# EAGLE board FindMeSAT_MB_1V0 (EAGLE 7.7.0)
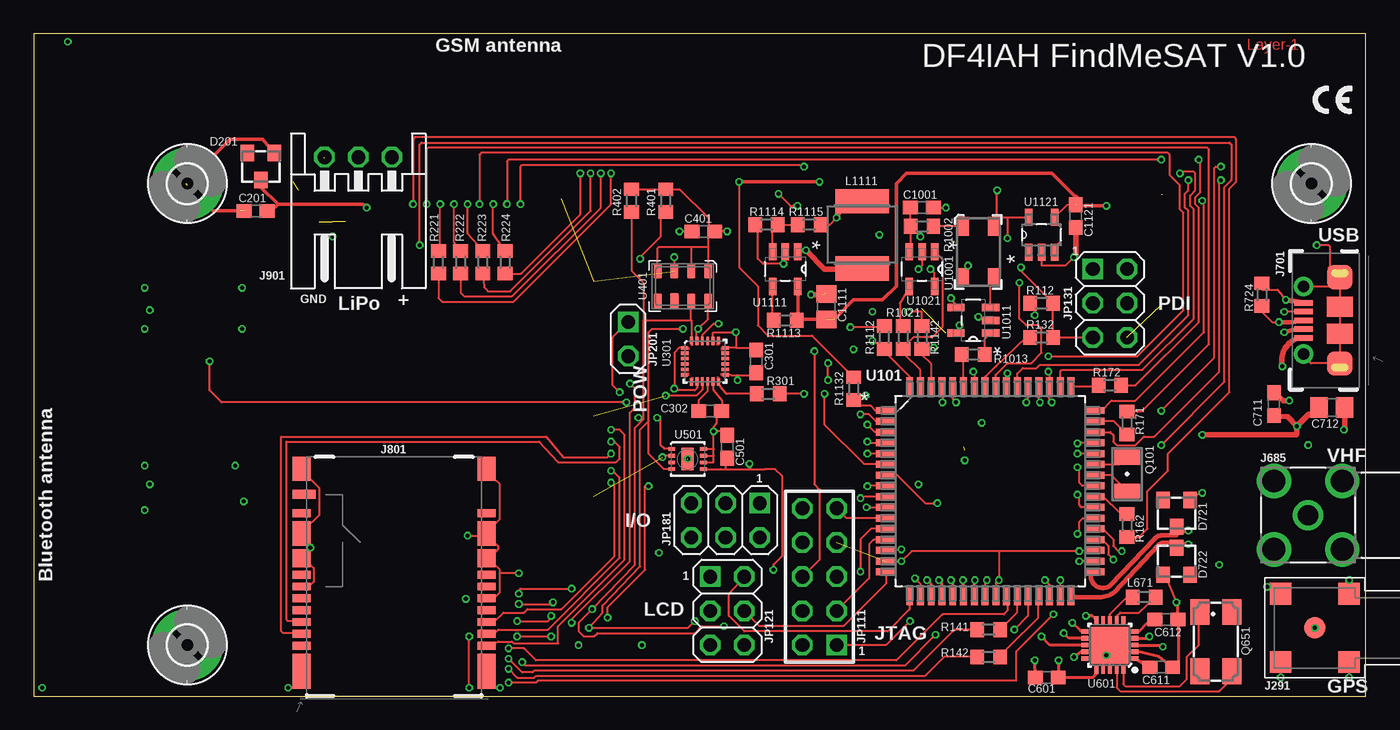
[diagram p12: board, top side]
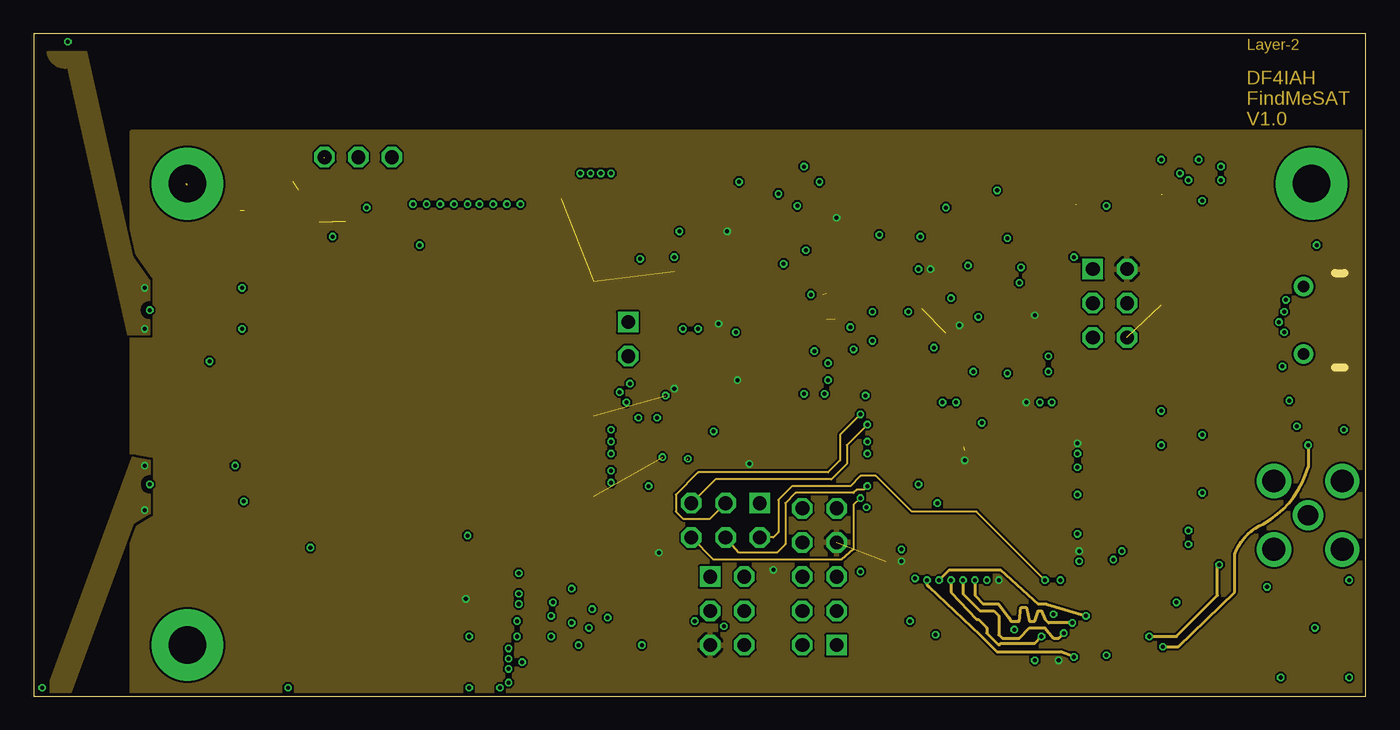
[diagram p13: board, inner layer g2]
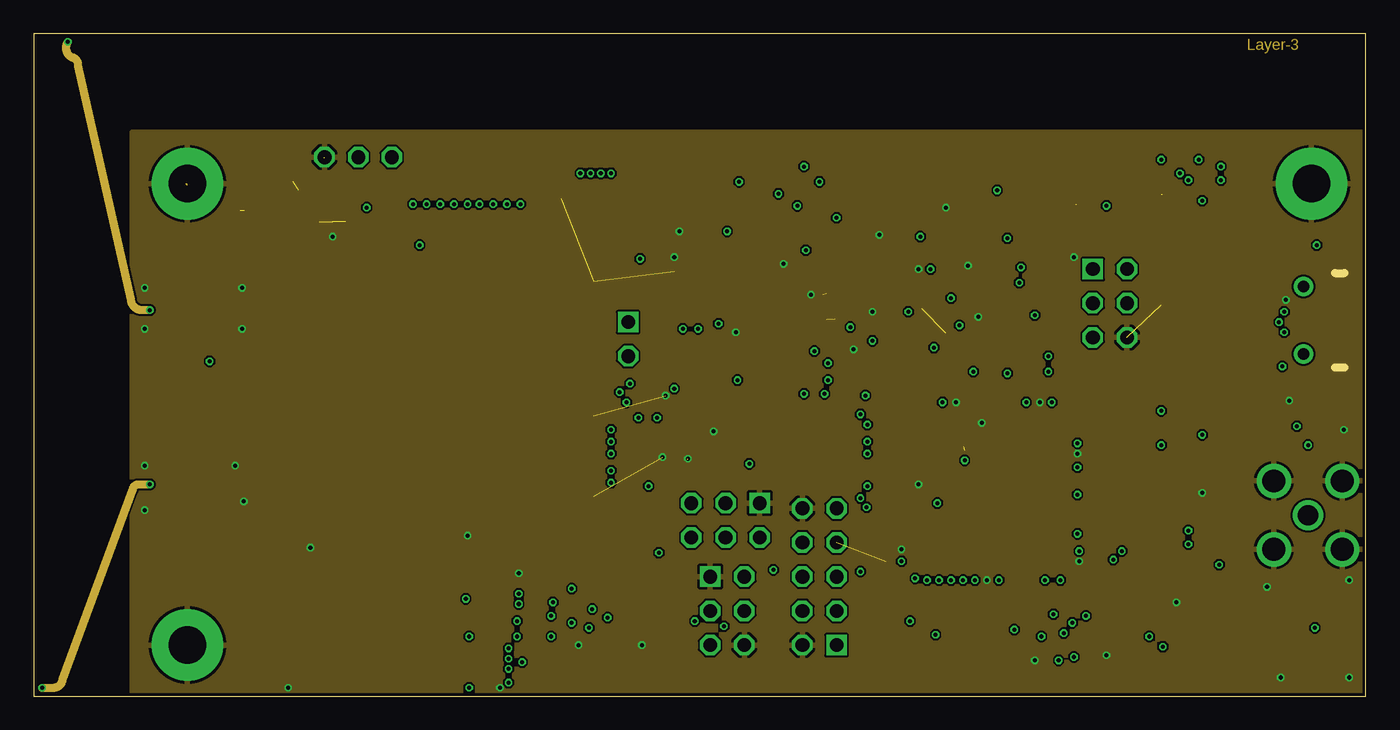
[diagram p14: board, inner layer g15]
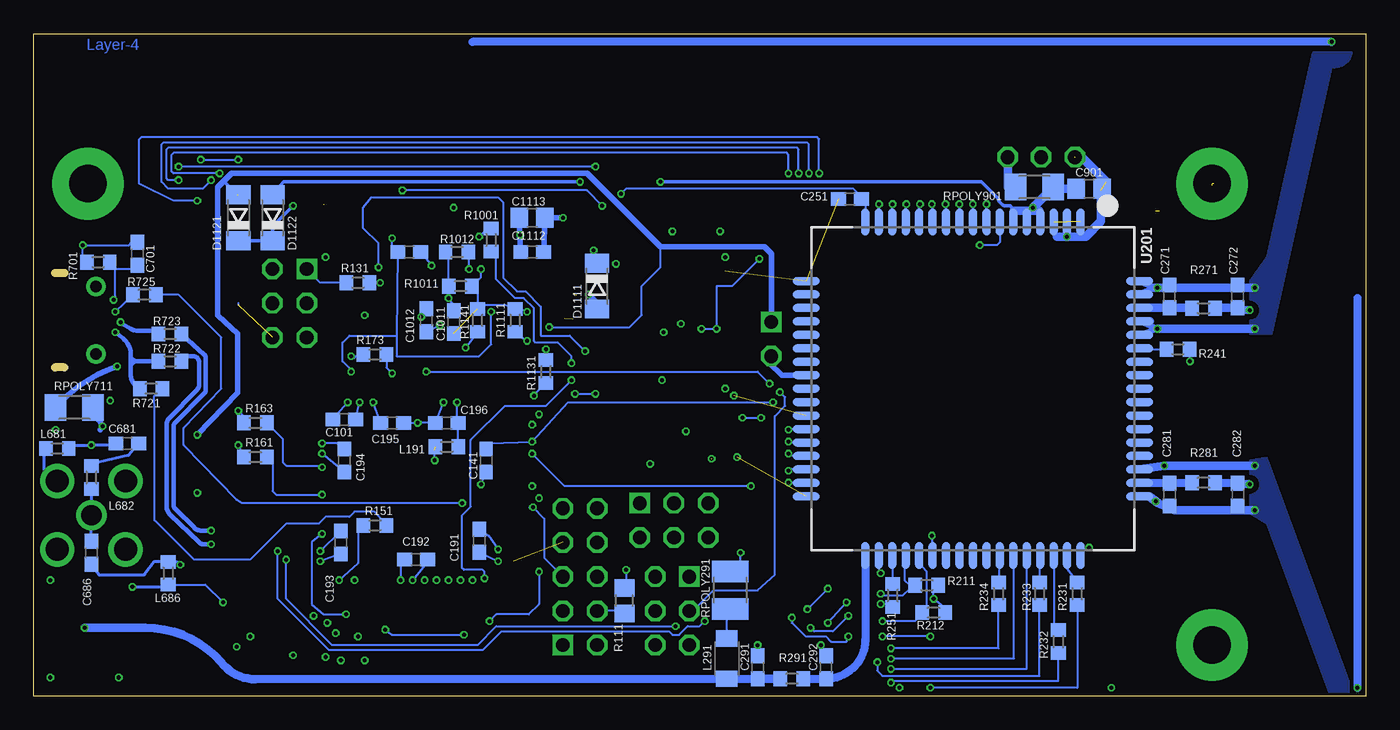
[diagram p15: board, bottom side, seen from below]

Size 99.04 x 49.23 mm. Coordinates in mm from the lower left corner, seen from the top.
Outline: 99.04,49.23 0,49.23 0,0 99.04,0 99.04,49.23
Copper layers (1+2*15+16): Top 0.018mm / dielectric 0.36mm / g2 0.035mm / dielectric 0.71mm / g15 0.035mm / dielectric 0.36mm / Bottom 0.018mm
Design rules "FindMeSAT_MB_1V0 *": minimum track width 0.15mm, minimum drill 0.3mm, track to track 0.15mm, track to pad 0.15mm, pad to pad 0.15mm, via to via 0.15mm, smd to smd 0mil, copper to edge 0.25mm, drill to drill 0.35mm, minimum pad ring 0.175mm, minimum via ring 0.125mm, stop-mask expansion 0.05mm, vias tented up to drill 0.35mm, thermal gap 0.2mm
Net classes: 1 pwr2A: width 0.8 mm; 2 R50: width 0.64 mm, clearance 0.55 mm; 3 R90_USB: width 0.35 mm, clearance 0.15 mm; 4 pwrA5: width 0.4 mm; 5 R75: width 0.3 mm, clearance 0.2 mm; 6 R110_SPI: width 0.225 mm, clearance 0.15 mm
tKeepout: area 0,0 to 99.1,49.2
bKeepout: area 0,0 to 99.1,49.2
tRestrict: area 21.6,1.3 to 31.8,17.8
bRestrict: area 19.1,12.7 to 39.4,33

## Footprints (pad centres in the part's own frame; a part is rotated, then mirrored left to right if it is on the bottom)
C0603 = smd 1.1 x 1: 1 -0.85,0; 2 0.85,0
C0805 = smd 1.3 x 1.5: 1 -0.95,0; 2 0.95,0
TO236 = smd 1 x 1.2: A -1,-1; C 0,1; NC 1,-1
SOD80C = smd 1.4 x 1.8: A 1.7,0; C -1.7,0
2,8-PAD = drill 2.8 pad 5.334: B2,8 0,0
MCX-J-P-X-RA-SM1 = smd 1.6 x 1.6: 1 0,0; 2 -2.54,2.54; 3 2.54,2.54; 4 -2.54,-2.54; 5 2.54,-2.54
SMA_SMT_AMPHENOL_901-143 = drill 1.499: 1 0,0 | drill 1.702: 2 -2.54,2.54; 3 -2.54,-2.54; 4 2.54,-2.54; 5 2.54,2.54
USB-B-MICRO-SMD_MOLEX-105017-0001 = smd 0.4 x 1.35: D+ 0,4.15; D- -0.65,4.15; GND 1.3,4.15; ID 0.65,4.15; VBUS -1.3,4.15 | drill 0.85 pad 1.45: JSHIELD -2.5,4.15; JSHIELD@2 2.5,4.15 | smd 1.8 x 1.9: JSHIELD@3 -3.2,1.45; JSHIELD@6 3.2,1.45 | smd 1.5 x 1.9: JSHIELD@4 -1,1.45; JSHIELD@5 1,1.45
MICROSIM-8P_SDCARD-8P_MOLEX-104642-1610 = smd 1.35 x 2.6: G1 -6.875,-7.04; G8 6.875,-7.04 | smd 1.35 x 1.34: G2 -6.875,1.36; G7 6.875,1.36 | smd 1.35 x 1.84: G3 -6.875,3.2; G6 6.875,3.2 | smd 1.35 x 1.8: G4 -6.875,8.01; G5 6.875,8.01 | smd 1.35 x 0.58: S1 6.875,-5.13; S2 6.875,-4.25; S3 -6.875,-4.25; S4 -6.875,-5.13; S5 6.875,-1.61; S6 6.875,-3.37; S7 -6.875,-3.37; S8 -6.875,-1.61; T1 6.875,4.71; T2 6.875,0.15; T3 6.875,-0.73; T4 6.875,-2.49; T5 -6.875,-2.49; T6 -6.875,-0.73; T7 -6.875,0.15; T8 -6.875,4.71 | smd 1.7 x 0.7: SW -6.7,6.125
JST_S3B-XH-A = drill 1.016 octagon: 1 -2.5,-4.5; 2 0,-4.5; 3 2.5,-4.5
AVR-JTAG-10 = drill 1.016 square: 1 -5.08,-1.27 | drill 1.016 octagon: 2 -5.08,1.27; 3 -2.54,-1.27; 4 -2.54,1.27; 5 0,-1.27; 6 0,1.27; 7 2.54,-1.27; 8 2.54,1.27; 9 5.08,-1.27; 10 5.08,1.27
2X03 = drill 1.016 square: 1 -2.54,-1.27 | drill 1.016 octagon: 2 -2.54,1.27; 3 0,-1.27; 4 0,1.27; 5 2.54,-1.27; 6 2.54,1.27
1X02 = drill 1.016 square: 1 0,0 | drill 1.016 octagon: 2 0,2.54
R0603 = smd 1 x 1.1: 1 -0.85,0; 2 0.85,0
L3216C = smd 1.2 x 1.6: 1 -1.5,0; 2 1.5,0
L5650M = smd 1.8 x 4: 1 -2.5,0; 2 2.5,0
ABS07 = smd 1.1 x 1.9: 1 -1.25,0; 2 1.25,0
CTS406 = smd 1.9 x 1.4: 1 -2.2,-1.2; 2 2.2,-1.2; 3 2.2,1.2; 4 -2.2,1.2
R0805 = smd 1.3 x 1.5: 1 -0.95,0; 2 0.95,0
R1210 = smd 1.6 x 2.7: 1 -1.4,0; 2 1.4,0
M1206 = smd 1.6 x 2: 1 -1.4,0; 2 1.4,0
QFP80P1600X1600X120-64N = smd 1.473 x 0.508: 1 -7.747,5.994; 2 -7.747,5.207; 3 -7.747,4.394; 4 -7.747,3.607; 5 -7.747,2.794; 6 -7.747,2.007; 7 -7.747,1.194; 8 -7.747,0.406; 9 -7.747,-0.406; 10 -7.747,-1.194; 11 -7.747,-2.007; 12 -7.747,-2.794; 13 -7.747,-3.607; 14 -7.747,-4.394; 15 -7.747,-5.207; 16 -7.747,-5.994; 33 7.747,-5.994; 34 7.747,-5.207; 35 7.747,-4.394; 36 7.747,-3.607; 37 7.747,-2.794; 38 7.747,-2.007; 39 7.747,-1.194; 40 7.747,-0.406; 41 7.747,0.406; 42 7.747,1.194; 43 7.747,2.007; 44 7.747,2.794; 45 7.747,3.607; 46 7.747,4.394; 47 7.747,5.207; 48 7.747,5.994 | smd 0.508 x 1.473: 17 -5.994,-7.747; 18 -5.207,-7.747; 19 -4.394,-7.747; 20 -3.607,-7.747; 21 -2.794,-7.747; 22 -2.007,-7.747; 23 -1.194,-7.747; 24 -0.406,-7.747; 25 0.406,-7.747; 26 1.194,-7.747; 27 2.007,-7.747; 28 2.794,-7.747; 29 3.607,-7.747; 30 4.394,-7.747; 31 5.207,-7.747; 32 5.994,-7.747; 49 5.994,7.747; 50 5.207,7.747; 51 4.394,7.747; 52 3.607,7.747; 53 2.794,7.747; 54 2.007,7.747; 55 1.194,7.747; 56 0.406,7.747; 57 -0.406,7.747; 58 -1.194,7.747; 59 -2.007,7.747; 60 -2.794,7.747; 61 -3.607,7.747; 62 -4.394,7.747; 63 -5.207,7.747; 64 -5.994,7.747
SIM808 = smd 2 x 0.6: P$1 -12.4,8; P$2 -12.4,7; P$3 -12.4,6; P$4 -12.4,5; P$5 -12.4,4; P$6 -12.4,3; P$7 -12.4,2; P$8 -12.4,1; P$9 -12.4,0; P$10 -12.4,-1; P$11 -12.4,-2; P$12 -12.4,-3; P$13 -12.4,-4; P$14 -12.4,-5; P$15 -12.4,-6; P$16 -12.4,-7; P$17 -12.4,-8; P$35 12.4,-8; P$36 12.4,-7; P$37 12.4,-6; P$38 12.4,-5; P$39 12.4,-4; P$40 12.4,-3; P$41 12.4,-2; P$42 12.4,-1; P$43 12.4,0; P$44 12.4,1; P$45 12.4,2; P$46 12.4,3; P$47 12.4,4; P$48 12.4,5; P$49 12.4,6; P$50 12.4,7; P$51 12.4,8 | smd 0.6 x 2: P$18 -8,-12.4; P$19 -7,-12.4; P$20 -6,-12.4; P$21 -5,-12.4; P$22 -4,-12.4; P$23 -3,-12.4; P$24 -2,-12.4; P$25 -1,-12.4; P$26 0,-12.4; P$27 1,-12.4; P$28 2,-12.4; P$29 3,-12.4; P$30 4,-12.4; P$31 5,-12.4; P$32 6,-12.4; P$33 7,-12.4; P$34 8,-12.4; P$52 8,12.4; P$53 7,12.4; P$54 6,12.4; P$55 5,12.4; P$56 4,12.4; P$57 3,12.4; P$58 2,12.4; P$59 1,12.4; P$60 0,12.4; P$61 -1,12.4; P$62 -2,12.4; P$63 -3,12.4; P$64 -4,12.4; P$65 -5,12.4; P$66 -6,12.4; P$67 -7,12.4; P$68 -8,12.4
QFN24-3X3 = smd 0.495 x 0.25: 1 -1.552,1; 6 -1.552,-1; 13 1.552,-1; 18 1.552,1 | smd 0.6 x 0.25: 2 -1.5,0.6; 3 -1.5,0.2; 4 -1.5,-0.2; 5 -1.5,-0.6; 14 1.5,-0.6; 15 1.5,-0.2; 16 1.5,0.2; 17 1.5,0.6 | smd 0.25 x 0.495: 7 -1,-1.552; 12 1,-1.552; 19 1,1.552; 24 -1,1.552 | smd 0.25 x 0.6: 8 -0.6,-1.5; 9 -0.2,-1.5; 10 0.2,-1.5; 11 0.6,-1.5; 20 0.6,1.5; 21 0.2,1.5; 22 -0.2,1.5; 23 -0.6,1.5
MS5607-02BA = smd 1.1 x 0.6: 1 -1.1,1.875; 2 -1.1,0.625; 3 -1.1,-0.625; 4 -1.1,-1.875; 5 1.1,-1.875; 7 1.1,0.625; 8 1.1,1.875 | smd 1.1 x 0.67: 6 1.1,-0.625
DFN8/SHT = smd 0.55 x 0.25: 1 0.075,2; 2 0.075,1.5; 3 0.075,1; 4 0.075,0.5; 5 2.425,0.5; 6 2.425,1; 7 2.425,1.5; 8 2.425,2 | smd 0.9 x 1.7: 9 1.25,1.25
QFN20-4X4-0P5-PAD = smd 0.6 x 0.35: 1 -1.85,1; 2 -1.85,0.5; 3 -1.85,0; 4 -1.85,-0.5; 5 -1.85,-1; 11 1.85,-1; 12 1.85,-0.5; 13 1.85,0; 14 1.85,0.5; 15 1.85,1 | smd 0.35 x 0.6: 6 -1,-1.85; 7 -0.5,-1.85; 8 0,-1.85; 9 0.5,-1.85; 10 1,-1.85; 16 1,1.85; 17 0.5,1.85; 18 0,1.85; 19 -0.5,1.85; 20 -1,1.85 | smd 2.75 x 2.75: 21 0,0
CFPT-141 = smd 0.9 x 1.4: 1 -1.15,1.9; 2 -1.15,-1.9; 3 1.15,-1.9; 4 1.15,1.9
SOT-23-5 = smd 1.27 x 0.559: 1 -1.295,0.94; 2 -1.295,0; 3 -1.295,-0.94; 4 1.295,-0.94; 5 1.295,0.94
SOT95P280X145-5N = smd 1.27 x 0.559: 1 -1.295,0.94; 2 -1.295,0; 3 -1.295,-0.94; 4 1.295,-0.94; 5 1.295,0.94
SOT95P285X120-5N = smd 1.27 x 0.533: 1 -1.295,0.965; 2 -1.295,0; 3 -1.295,-0.965; 4 1.295,-0.965; 5 1.295,0.965

## Placement (x,y rotation side)
C101  100nF  [C0603]  75.95,20.57 0 bottom
C141  100pF  [C0603]  65.41,17.53 270 bottom
C191  100nF  [C0603]  65.91,11.56 90 bottom
C192  100nF  [C0603]  70.61,10.16 0 bottom
C193  100nF  [C0603]  76.2,11.43 270 bottom
C194  100nF  [C0603]  75.95,17.53 270 bottom
C195  100nF  [C0603]  72.39,20.32 0 bottom
C196  100nF  [C0603]  68.33,20.32 180 bottom
C201  100pF  [C0603]  16.51,36.07 180 top
C251  100pF  [C0603]  38.35,36.96 180 bottom
C271  [C0603]  14.61,29.72 90 bottom
C272  [C0603]  9.53,29.72 90 bottom
C281  [C0603]  14.61,14.99 270 bottom
C282  [C0603]  9.53,14.99 270 bottom
C291  [C0603]  45.21,2.16 90 bottom
C292  [C0603]  40.13,2.16 90 bottom
C301  100nF  [C0603]  53.72,24.89 90 top
C302  100nF  [C0603]  50.29,21.21 0 top
C401  100nF  [C0603]  49.78,34.54 180 top
C501  100nF  [C0603]  51.56,18.54 90 top
C601  100nF  [C0603]  75.31,1.4 180 top
C611  100nF  [C0603]  83.82,2.16 0 top
C612  100nF  [C0603]  84.2,5.71 0 top
C681  68pF  [C0603]  92.08,18.8 0 bottom
C686  18pF  [C0603]  94.74,10.67 90 bottom
C701  1nF  [C0603]  91.31,32.89 270 bottom
C711  100nF  [C0603]  92.2,21.72 90 top
C712  47uF  [C0805]  96.52,21.46 0 top
C901  100uF  [C0805]  20.57,37.72 0 bottom
C1001  100nF  [C0603]  66.04,36.32 0 top
C1002  100nF  [C0603]  71.12,33.02 0 bottom
C1011  100pF  [C0603]  67.82,27.81 270 bottom
C1012  100nF  [C0603]  69.85,27.94 90 bottom
C1111  47uF  [C0805]  58.93,28.96 90 top
C1112  100nF  [C0603]  61.98,33.02 180 bottom
C1113  47uF  [C0805]  61.98,35.56 180 bottom
C1121  100nF  [C0603]  77.47,35.69 270 top
D201  BZX84-5V1  [TO236]  16.89,39.37 180 top
D721  BZX84-3V6  [TO236]  84.96,13.59 180 top
D722  BZX84-3V6  [TO236]  84.96,10.03 0 top
D1111  CRS08  [SOD80C]  57.15,30.48 270 bottom
D1121  CRS08  [SOD80C]  83.82,35.56 90 bottom
D1122  CRS08  [SOD80C]  81.28,35.56 90 bottom
H1201  MOUNT-PAD-ROUND2.8  [2,8-PAD]  95,38.1 180 top
H1203  MOUNT-PAD-ROUND2.8  [2,8-PAD]  11.43,38.1 180 top
H1204  MOUNT-PAD-ROUND2.8  [2,8-PAD]  11.43,3.81 180 top
J291  MCX-J-P-X-RA-SM1  [MCX-J-P-X-RA-SM1]  95.25,5.08 270 top
J685  SMA_CON  [SMA_SMT_AMPHENOL_901-143]  94.74,13.46 270 top
J701  MOLEX_105017-0001  [USB-B-MICRO-SMD_MOLEX-105017-0001]  98.55,27.94 90 top
J801  MICROSIM-8P_SDCARD-8P_MOLEX-104642-1610  [MICROSIM-8P_SDCARD-8P_MOLEX-104642-1610]  26.8,8.89 0 top
J901  JST_S3B-XH-A  [JST_S3B-XH-A]  24.13,35.56 180 top
JP111  [AVR-JTAG-10]  58.42,8.89 90 top
JP121  [2X03]  51.56,6.35 270 top
JP131  [2X03]  80.01,29.21 270 top
JP181  [2X03]  51.44,13.08 180 top
JP201  POW  [1X02]  44.2,27.81 180 top
L191  10uH  [R0603]  68.33,18.54 180 bottom
L291  WE-CBF_300R  [L3216C]  47.5,2.79 270 bottom
L671  22nH  [R0603]  82.55,7.37 0 top
L681  150nH  [R0603]  97.28,18.41 180 bottom
L682  68nH  [R0603]  94.74,16.26 270 bottom
L686  150nH  [R0603]  89.03,9.14 90 bottom
L1111  4.7uH  [L5650M]  61.59,34.29 270 top
Q101  ABS07-32.768KHZ  [ABS07]  81.28,16.51 90 top
Q651  ABM3B-16MHZ-10-R50-1-U  [CTS406]  87.88,4.06 270 top
R111  0R  [R0805]  55.12,7.11 90 bottom
R112  10kR  [R0603]  74.93,29.21 180 top
R131  68R  [R0603]  74.93,30.73 0 bottom
R132  68R  [R0603]  74.93,26.67 180 top
R141  68R  [R0603]  70.99,4.95 180 top
R142  68R  [R0603]  70.99,2.92 180 top
R151  68R  [R0603]  73.66,12.7 0 bottom
R161  4.7kR  [R0603]  82.55,17.78 180 bottom
R162  68R  [R0603]  81.28,12.7 270 top
R163  68R  [R0603]  82.55,20.32 180 bottom
R171  68R  [R0603]  81.28,20.32 90 top
R172  68R  [R0603]  80.01,23.11 0 top
R173  68R  [R0603]  73.66,25.4 180 bottom
R211  10kR  [R0603]  32.64,8.26 180 bottom
R212  10kR  [R0603]  32.13,6.22 180 bottom
R221  68R  [R0603]  30.1,32.26 90 top
R222  68R  [R0603]  31.75,32.26 90 top
R223  68R  [R0603]  33.4,32.26 90 top
R224  68R  [R0603]  35.05,32.26 90 top
R231  68R  [R0603]  21.46,7.62 270 bottom
R232  68R  [R0603]  22.86,4.06 270 bottom
R233  68R  [R0603]  24.26,7.62 270 bottom
R234  68R  [R0603]  27.3,7.62 270 bottom
R241  68R  [R0603]  13.97,25.78 0 bottom
R251  68R  [R0603]  35.18,7.49 90 bottom
R271  [R0603]  12.06,28.83 0 bottom
R281  [R0603]  12.06,15.88 0 bottom
R291  [R0603]  42.67,1.31 0 bottom
R301  68R  [R0603]  54.61,22.48 0 top
R401  10kR  [R0603]  46.99,36.83 90 top
R402  10kR  [R0603]  44.45,36.83 90 top
R701  330kR  [R0603]  94.23,32.26 0 bottom
R721  1.5kR  [R0603]  90.3,22.86 0 bottom
R722  68R  [R0603]  88.9,24.89 0 bottom
R723  68R  [R0603]  88.9,26.92 0 bottom
R724  1MR  [R0603]  91.31,29.84 90 top
R725  68R  [R0603]  90.81,29.84 0 bottom
R1001  100kR  [R0603]  65.02,33.91 90 bottom
R1002  10kR  [R0603]  66.04,34.92 0 top
R1011  100kR  [R0603]  67.31,30.48 180 bottom
R1012  470kR  [R0603]  67.56,33.02 0 bottom
R1013  47R  [R0603]  69.85,25.4 180 top
R1021  27R  [R0603]  64.64,26.67 270 top
R1111  4.02kR  [R0603]  63.25,27.94 270 bottom
R1112  6.04kR  [R0603]  63.25,26.67 90 top
R1113  100kR  [R0603]  55.88,27.94 180 top
R1114  15kR  [R0603]  54.48,35.05 0 top
R1115  68kR  [R0603]  57.66,35.05 0 top
R1131  4.02kR  [R0603]  60.96,24.13 90 bottom
R1132  6.04kR  [R0603]  60.96,22.86 270 top
R1141  4.02kR  [R0603]  66.04,27.94 270 bottom
R1142  2.0kR  [R0603]  66.04,26.67 90 top
RPOLY291  50mA/150mA  [R1210]  47.24,7.87 90 bottom
RPOLY711  0.5A/1.0A  [M1206]  96.01,21.46 0 bottom
RPOLY901  1.1A/2.2A  [M1206]  24.64,37.85 0 bottom
U101  ATXMEGA256A3BU-AU  [QFP80P1600X1600X120-64N]  71.12,15.24 0 top
U201  SIM808  [SIM808]  29.21,22.86 270 bottom
U301  MPU-9250  [QFN24-3X3]  49.91,24.89 0 top
U401  MS5607-02BA03  [MS5607-02BA]  48.26,30.48 270 top
U501  SHT31-DIS  [DFN8/SHT]  47.37,16.38 0 top
U601  AX5243  [QFN20-4X4-0P5-PAD]  80.01,3.81 180 top
U1001  CFPT-141-20MHZ  [CFPT-141]  70.23,33.02 0 top
U1011  OPA354  [SOT-23-5]  69.85,27.94 180 top
U1021  OPA354  [SOT-23-5]  66.04,31.75 270 top
U1111  LM2831YMF  [SOT95P280X145-5N]  55.88,31.75 270 top
U1121  LM4120IM5-3.0  [SOT95P285X120-5N]  74.93,34.29 90 top

## Tracks (layer width: path | path; a pad name or v marks a point on that pad's centre or on a via)
+3V0  (via drill 0.3)
  Top 0.15: U1001.4 71.38,35.3 | 71.38,35.3 71.67,35.59 72.39,35.59 | 72.39,35.59 U1121.5 | 72.39,35.59 v72.39,34.04 | R1142.2 66.04,28.57 v65.02,28.57 | 75.44,23.06 U101.51 | v71.63,37.59 71.63,35.56 71.38,35.31 71.38,35.3 | v55.37,37.34 56.26,36.45 v56.77,36.45 | v75.69,21.84 75.51,22.02 U101.51 | v75.44,24.13 75.51,24.05 U101.51
  Bottom 0.15: C101.1 v75.69,21.84 | U201.P$17 37.17,36.96 C251.1 37.59,37.17 38.1,37.72 54.99,37.72 v55.37,37.34 | v72.39,34.04 72.39,33.34 C1002.1 72.07,26.8 | 72.07,26.8 72.07,25.27 65.91,25.27 65.02,26.16 v65.02,28.57 | v75.44,24.13 75.44,24.26 76.07,24.89 76.07,26.29 75.56,26.8 72.07,26.8 | v56.77,36.45 57.91,37.59 v71.63,37.59
+3V3  (via drill 0.3)  (2 unrouted)
  Top 0.15: U101.45 v77.6,18.8 | U101.35 v77.72,10.79 71.75,10.79 | U101.15 v64.52,10.03 65.28,10.79 71.75,10.79 | R1115.2 59.18,35.05 v59.69,35.56 | L1111.1 59.94,36.2 | U1021.5 66.98,31.45 v66.67,31.75 | U1011.5 v68.83,27.56 | R112.2 74.42,28.87 v74.42,28.32 | U301.22 49.71,26.85 50.55,27.69 v50.93,27.69 | U301.13 51.86,23.88 52.32,23.88 | U301.1 47.99,25.89 47.62,25.53 v47.62,22.86 47.75,22.73 49.15,22.73 49.31,22.89 U301.8 | U501.5 51.07,16.89 51.44,16.89 | 51.44,16.89 53.34,16.89 | C501.1 51.44,17.57 51.44,16.89 | 76.2,1.4 C601.1 | 52.32,23.88 53.72,23.88 C301.1 | U101.25 71.53,8.41 v71.75,8.64 71.75,10.79 | v73.79,21.84 73.91,21.97 U101.53 | U401.4 46.35,31.61 46.35,33.27 46.48,33.4 48.9,33.4 | v51.56,34.54 50.67,34.54 | 50.67,34.54 C401.1 50.16,34.25 50.16,33.4 | U401.1 50.16,31.61 50.16,33.4 | 48.9,33.4 50.16,33.4 | U401.2 48.9,31.58 48.9,33.4 | v53.21,17.27 53.21,17.02 53.34,16.89 | 50.67,34.54 50.29,34.92 50.16,34.92 50.16,35.56 48.01,37.68 47.5,37.68 47.37,37.59 46.99,37.72 arc-180 R401.2 R402.2 | v54.99,9.4 54.99,9.78 55.63,10.41 55.63,16.38 55.12,16.89 54.4,16.89 | v52.32,23.5 52.32,23.88 | 53.34,16.89 54.36,16.89
  Top 0.225: 76.2,1.4 78.74,1.4 79.01,1.67 U601.16 | 76.2,1.4 76.2,1.27 | 76.2,1.4 v76.2,2.67
  Top 0.406: 59.94,36.2 v59.69,35.56
  Bottom 0.15: C195.1 v73.79,21.84 | C194.1 76.45,18.8 v77.6,18.8 | C193.1 v77.72,10.79 | C191.1 v64.52,10.03 | C192.1 71.75,10.03 v71.75,8.64 | R1012.2 66.71,31.84 v66.67,31.75 | C1012.1 v68.83,27.56 | v46.48,10.67 46.48,9.53 46.99,9.02 RPOLY291.2 | R212.1 31.37,6.6 v32.13,7.24 32.17,7.28 32.17,7.83 32.13,7.87 R211.1 | v54.99,9.4 54.99,8.51 55.12,8.26 R111.2 | v69.22,17.53 69.22,18.29
  Bottom 0.225: RPOLY291.2 47.37,9.53
  Bottom 0.406: C1112.1 C1113.1 v59.69,35.56
  pour g2 (rank 2): 99.06,41.91 7.32,41.91 7.32,0 99.06,0
+5V  (via drill 0.3)  (1 unrouted)
  Top 0.15: R1112.2 63.08,27.52 62.99,27.43 v60.71,27.43 | v43.56,22.61 43.05,23.11 43.05,26.67 JP201.1
  Top 0.406: v86.87,19.43 93.85,19.43 93.92,19.5 v93.92,20.07 | C712.1 95.57,21.27 95.25,20.95 94.81,20.95 v93.92,20.07 | C711.1 93.22,20.77 v93.92,20.07
  Bottom 0.15: 84.74,38.1 85.09,38.1 | JP121.3 50.04,6.35 48.51,7.87 45.21,7.87 43.94,9.02 43.94,20.83 43.18,21.59 43.18,22.23 v43.56,22.61 | v60.71,27.43 54.74,27.43 53.85,28.32 53.85,30.48 52.45,31.88 52.45,33.27 52.32,33.4
  Bottom 0.254: 83.9,37.26 84.74,38.1
  Bottom 0.406: v86.87,19.43 83.88,22.54 83.88,26.95 85.34,28.32 85.34,37.85 85.09,38.1 84.33,38.86 57.91,38.86 52.45,33.4 52.32,33.4 44.7,33.4 44.2,32.89 JP201.1 | 83.9,37.26 83.82,37.34 | RPOLY711.2 94.61,21.59 94.36,21.34 94.36,20.7 94.17,20.51 v93.92,20.07 94.11,19.81
AD_3V0  (via drill 0.3)
  Top 0.15: U101.62 66.73,24.71 66.04,25.4 R1142.1 v66.93,25.91
  Bottom 0.15: R1141.2 v66.93,25.91
AD_5V0  (via drill 0.3)
  Top 0.15: U101.64 65.13,23.77 63.5,25.4 R1112.1 63.33,25.82 v62.36,26.42
  Bottom 0.15: R1111.2 63.41,27.09 v62.36,26.42
AD_VBAT  (via drill 0.3)
  Top 0.15: U101.1 62.59,21.23 62.23,21.59 61.38,21.59 R1132.2 61.3,22.35 v61.85,22.35
  Bottom 0.15: v61.85,22.35 61.63,22.61 R1131.1
AD_VCTCXO
  Top 0.15: U101.63 65.91,24.26 64.77,25.4 R1021.2 64.77,26.04 65.41,26.67 66.8,26.67 67.56,27.43 67.56,32.46 U1021.1
AVCC  (via drill 0.3)
  Top 0.15: U101.61 67.56,22.99 v67.56,21.84
  Bottom 0.15: v67.56,21.84 67.56,20.32 C196.1 L191.1
AX_ANT
  Bottom 0.225: C686.2 J685.1 L682.2
AX_ANT_I
  Bottom 0.225: C681.2 91.99,17.91 94.19,17.4 L682.1
AX_ANTN  (via drill 0.3)
  Top 0.225: U601.4 82.8,4.31 v82.93,4.45
  g2 0.225: v82.93,4.45 84.96,4.45 88.01,7.49 88.01,9.65 v88.14,9.78
  Bottom 0.225: C686.1 94.19,9.02 90.81,9.02 90.08,9.99 L686.2 88.35,9.99 v88.14,9.78
AX_ANTP  (via drill 0.3)
  Top 0.225: U601.3 83.82,3.81 v83.95,3.68
  g2 0.225: v83.95,3.68 85.09,3.68 89.28,7.75 89.28,10.54 arc-45 91.44,12.83 arc45 94.74,17.02 v94.74,18.67
  Bottom 0.225: L681.1 96.18,18.67 v94.74,18.67 93.05,18.67 C681.1
AX_CLK  (via drill 0.3)
  Top 0.225: U601.11 77.85,4.87 v77.22,5.46 | U101.23 69.93,8.59 v69.98,8.64
  g2 0.225: v69.98,8.64 69.98,7.49 70.61,6.86 71.75,6.86 72.52,5.84 72.64,5.59 73.28,5.59 73.41,6.6 73.79,6.6 74.04,5.59 74.42,5.59 74.68,6.35 74.93,6.35 75.18,5.71 75.44,5.46 v77.22,5.46
AX_IRQ  (via drill 0.3)
  Top 0.225: v77.34,2.92 77.85,3.3 U601.14 | U101.19 66.73,8.33 v66.42,8.64
  g2 0.225: v66.42,8.64 66.42,8.26 66.55,8.13 70.36,4.57 71.63,3.3 76.33,3.3 v77.34,2.92
AX_L1
  Top 0.15: U601.8 80.01,6.1 81.28,7.37 L671.1
AX_L2
  Top 0.15: U601.7 80.52,5.97 80.77,6.22 82.17,6.22 L671.2
AX_MISO  (via drill 0.3)
  Top 0.225: U601.12 76.96,4.32 v76.58,4.7 | v69.09,8.64 69.09,7.52 U101.22
  g2 0.225: v69.09,8.64 69.09,7.62 70.36,6.35 71.37,6.35 71.75,5.97 71.75,4.57 72.01,4.32 73.28,4.32 74.04,5.08 75.18,5.08 75.82,4.32 76.2,4.32 v76.58,4.7
AX_MOSI  (via drill 0.3)
  Top 0.225: U601.13 75.56,3.81 v74.93,4.45 | U101.21 68.33,8.51 v68.2,8.64
  g2 0.225: v68.2,8.64 68.2,7.75 70.1,5.71 70.23,5.71 70.87,5.08 70.87,4.7 71.75,3.81 71.88,3.94 74.42,3.94 v74.93,4.45
AX_SEL  (via drill 0.3)
  Top 0.225: U601.10 78.7,5.97 v78.23,5.97 | U101.20 67.51,8.43 v67.31,8.64
  g2 0.225: v67.31,8.64 68.07,9.4 71.88,9.4 74.68,6.86 75.31,6.86 v78.23,5.97
BATTERY
  Bottom 0.64: RPOLY901.1 26.63,37.85 J901.1
BT_ANT  (via drill 0.3)
  g15 0.604: v0.64,0.64 1.4,0.64 arc90 2.16,1.27 7.37,15.37 arc-90 7.87,15.75 v8.64,15.75
  Bottom 0.604: v8.64,15.75 9.53,15.75 C282.1 | 0.64,29.59 v0.64,0.64
  Bottom 0.64: R281.2 C282.1
BT_RF
  Bottom 0.64: U201.P$53 C281.1 R281.1
CLK16N
  Top 0.15: U601.19 80.51,0.64 80.77,0.38 88.14,0.38 89.03,1.27 89.03,1.81
  Top 0.225: 89.03,1.81 Q651.3
CLK16P
  Top 0.15: U601.20 81.01,0.91 81.15,0.76 85.22,0.76 85.72,1.27 85.72,2.92 86.61,3.81 86.61,5.18 Q651.1
CTS1  (via drill 0.3)
  Top 0.15: U101.55 72.31,23.93 v72.39,24
  Bottom 0.15: R173.1 72.81,24.42 v72.39,24
DCD1
  Top 0.15: R171.1 80.3,20.45 U101.47
DTR1  (via drill 0.3)
  Top 0.15: U101.46 80.06,19.63 80.26,19.43 80.26,18.92 80.52,18.67 81.92,18.67 82.55,19.3 83.31,19.3 88.14,24.13 88.14,38.23 v88.27,38.35 | R222.1 31.75,29.97 32,29.72 35.56,29.72 42.16,36.32 v42.16,38.86
  Bottom 0.15: v88.27,38.35 89.03,38.35 89.15,38.48 89.15,40.64 89.03,40.77 42.29,40.77 42.16,40.64 v42.16,38.86
EN
  Top 0.15: R1113.2 54.94,28.03 U1111.4
FB
  Top 0.15: U1111.3 54.94,34.66 R1114.2 R1115.1
GAM_RO
  Top 0.15: U301.10 50.11,22.68 49.44,22.01 C302.1
GND  (via drill 0.3)  (16 unrouted)
  Top 0.15: v97.79,8.64 J291.2 | v97.79,1.4 J291.3 | v92.71,1.4 J291.5 | v91.69,8.13 J291.4 | v64.52,10.92 63.42,10.79 U101.14 | 70.74,7.52 U101.24 70.71,8.48 v70.87,8.64 | 70.74,7.52 70.74,7.49 | 70.74,7.52 70.87,7.75 | U101.44 v77.6,18.03 | D722.A 84.33,8.51 v84.96,6.99 85.05,7.02 | U101.34 v77.72,10.03 | v55.75,32.13 54.23,32.13 53.85,32.51 53.85,34.84 R1114.1 | U1021.2 66.04,32 v65.79,31.75 | J801.T6 19.95,8.38 20.45,8.13 20.83,8.51 20.83,9.53 20.36,10 J801.G2 20.32,10.65 v20.57,11.05 20.19,11.69 J801.G3 20.32,12.74 20.19,12.45 21.21,13.46 21.21,15.49 19.92,16.78 J801.G4 | v18.92,0.64 19.92,0.64 J801.G1 20.32,2.1 20.32,0.89 | 33.53,1.14 33.53,1.96 J801.G8 33.67,0.62 v34.67,0.64 | U1011.2 71.12,27.94 arc-32 v70.23,28.19 | U1001.2 v69.47,32 | C1001.2 v67.82,36.32 | U1121.2 74.93,32 76.71,32 v77.34,32.64 77.47,32.77 | U301.9 49.71,22.79 49.28,22.35 v46.99,22.35 | U301.20 50.51,27.02 50.55,27.05 v52.2,27.05 52.2,25.89 | C501.2 51.27,19.68 v50.55,19.68 | U501.8 50.51,18.38 | 50.51,18.38 50.55,18.41 v50.55,19.68 | U501.7 50.52,17.88 | 50.52,17.88 50.55,17.91 50.55,18.35 50.51,18.38 | U301.11 50.51,22.77 51.18,21.97 51.18,21.63 C302.2 50.8,21.04 50.8,20.32 50.55,19.94 v50.55,19.68 | 34.29,7.37 33.76,7.24 J801.S5 34.08,7.28 34.29,7.37 | J801.G6 33.67,11.79 34.04,11.56 34.54,11.18 34.54,10.97 34.33,10.76 34.04,10.5 33.93,10.5 J801.G7 34.02,9.91 34.16,9.91 34.67,9.4 34.67,9.14 | J801.G6 33.68,12.22 34.67,13.21 34.67,15.77 34.16,16.26 33.67,16.75 J801.G5 | 34.29,7.37 34.67,7.75 34.67,9.14 | 52.2,25.89 U301.18 | D721.A 85.98,14.84 v86.87,15.11 | R724.2 91.31,30.23 92.46,30.23 v93.09,29.46 | U601.18 80.01,2.54
  Top 0.15: 80.01,2.54 U601.21 | U601.17 79.51,2.53 | 79.51,2.53 79.5,2.54 | U601.2 81.03,3.31 80.01,2.54 | 79.51,2.53 80.01,2.54 | 80.01,2.54 v79.76,3.05 | U501.2 46.74,17.88 v46.74,17.78 | 52.2,25.89 53.72,25.89 C301.2 | v68.58,21.84 68.33,22.1 U101.60 | v74.8,21.84 74.73,21.92 U101.52 | v36.07,9.14 34.67,9.14 | U401.3 47.63,32.63 v47.62,32.64 | v48.01,34.54 C401.2 | U501.6 50.53,17.38 50.55,17.4 50.55,17.86 50.52,17.88 | v32.26,11.94 33.52,11.94 J801.G6
  Top 0.225: C601.2 v74.42,2.67 | 81.03,3.31 81.03,3.3 | U601.2 82.17,3.3 83.69,2.92 C611.2 84.71,2.16 85.09,2.54 85.09,5.68 C612.2 85.05,7.02
  Top 0.254: D201.A 17.02,41.4 14.61,41.4 11.3,38.1 | 15.37,36.07 13.34,36.07 11.43,37.97
  Top 0.406: J701.GND v93.09,29.46 | U1111.2 v55.75,32.13 | C1121.2 77.47,32.77 | C712.2 97.47,19.75 v97.41,19.81 | C711.2 92.9,21.97 v93.34,21.97 | 58.67,29.84 v57.78,29.84
  Bottom 0.15: C292.2 v40.51,3.81 | C291.2 v45.21,3.81 | U201.P$36 36.2,10.45 36.2,9.27 v36.07,9.14 | C191.2 65.22,11.94 v64.52,10.92 | C192.2 70.1,9.59 v70.87,8.64 | C194.2 v77.6,18.03 | C101.2 v74.8,21.84 | v68.58,21.84 C196.2 v70.48,20.32 C195.2 | C193.2 v77.72,10.03 | D1111.A 57.15,29.21 | 62.93,34.35 v62.87,34.29 | v65.79,31.75 65.79,31.15 R1011.1 66.04,30.48 R1141.1 65.53,29.08 64.01,29.08 R1111.1 62.83,28.79 v62.36,28.57 | U201.P$51 21.21,10.79 21.04,10.97 20.7,10.97 v20.57,11.05 | v70.23,28.19 70.23,28.51 C1012.2 | C1002.2 v69.47,32 | R1131.2 v60.96,25.78 | v65.79,15.75 C141.2 | v93.09,29.46 92.96,29.72 92.96,31.75 | 92.96,31.75 93.38,32.17 R701.2 | C701.2 91.61,31.75 92.96,31.75 | L686.1 86.27,8.29 v84.96,6.99 | U201.P$40 32.21,11.89 v32.26,11.94 | 83.82,29.21 83.82,29.08
  Bottom 0.225: J685.2 98.26,16.85 98.26,18.29 L681.2 | v91.69,8.13 89.19,8.13 L686.1
  Bottom 0.406: 57.15,29.21 v57.78,29.84 | C1113.2 62.93,34.35 C1112.2 | 15.81,30.35 U201.P$68 | 15.79,30.35 U201.P$67 | U201.P$65 v15.49,27.3 U201.P$64
  Bottom 0.64: 15.81,30.35 15.79,30.35 v15.49,30.35 14.82,30.35 C271.2 14.1,30.35 9.91,30.35 C272.2 9.31,30.35 v8.26,30.35 | U201.P$65 16.05,27.86 | U201.P$64 16.19,26.86 | v8.26,13.84 9.49,13.84 | 9.49,13.84 arc90 C282.2 9.82,13.84 | 9.49,13.84 14.22,13.84 14.52,14.14 C281.2 arc37 v15.62,14.48 16.13,14.86 U201.P$52 | U201.P$54 v14.99,17.14 v8.26,17.14 | U201.P$2 v22.23,34.16 | v8.26,27.3 v15.49,27.3 | 21.59,40.01 21.08,40.01 19.3,38.23 | 22.99,34.16 20.83,34.16 19.68,35.31 19.68,37.59
  other vias: 48.64,17.65
  pour g15 (rank 2): 99.06,41.91 7.32,41.91 7.32,0 99.06,0
  pour Bottom (no thermals): 8.64,16.51 arc180 8.64,14.99 8.64,13.59 7.37,12.83 2.67,0.13 1.27,0.13 1.27,1.14 7.37,17.78 8.64,17.53
  pour Bottom (no thermals): 8.64,27.94 arc-180 8.64,29.46 8.64,30.86 7.37,32.64 3.94,47.88 1.02,47.88 arc90 2.54,46.74 6.99,26.92 8.64,26.92
  pour g2 (no thermals): 8.64,16.51 arc180 8.64,14.99 8.64,13.59 7.37,12.83 2.67,0.13 1.27,0.13 1.27,1.14 7.37,17.78 8.64,17.53
  pour g2 (no thermals): 8.64,27.94 arc-180 8.64,29.46 8.64,30.86 7.37,32.64 3.94,47.88 1.02,47.88 arc90 2.54,46.74 6.99,26.92 8.64,26.92
GPS_1PPS  (via drill 0.3)
  Top 0.15: v36.07,6.86 38.48,6.86 v38.61,6.99 | v44.32,23.24 44.7,22.86 44.7,21.46 44.32,21.08 44.32,10.03 40.01,5.71 v40.01,5.46 | 69.85,23.5 69.98,23.04 U101.58 69.93,24.05 v69.85,24.13
  Bottom 0.15: R251.1 35.34,6.86 v36.07,6.86 | v38.61,6.99 v40.01,5.46 | v69.85,24.13 45.21,24.13 v44.32,23.24
GPS_1PPS_DRV
  Bottom 0.15: U201.P$37 35.18,10.43 R251.2
GPS_ANT  (via drill 0.3)
  Bottom 0.15: C291.1 45.25,1.27 45.72,1.27 45.74,1.29 L291.2
  Bottom 0.64: R291.1 C291.1 82.55,1.27 arc53 85.09,2.54 arc-53 91.44,5.08 J291.1
  other vias: 95.25,5.08
GPS_PWR
  Bottom 0.15: L291.1 47.5,6.35 47.37,6.47 RPOLY291.1
GPS_RF_IN
  Bottom 0.15: 41.91,1.27 R291.2
  Bottom 0.6: U201.P$35 37.21,4.19 arc90 C292.1
  Bottom 0.64: C292.1 41.91,1.27
GSM_ANT  (via drill 0.3)
  g15 0.604: v8.64,28.7 8.13,28.7 arc-90 7.24,29.46 3.3,46.86 arc90 2.79,47.5 arc-90 v2.54,48.64
  Bottom 0.604: v8.64,28.7 9.53,28.7 C272.1 | v2.54,48.64 66.42,48.64
  Bottom 0.64: R271.2 11.3,28.87 C272.1
GSM_CTS  (via drill 0.3)
  Top 0.15: R223.2 32.26,34.38 v32.26,36.58
  Bottom 0.15: U201.P$12 32.21,36.53 arc-90 v32.26,36.58
GSM_DCD  (via drill 0.3)
  Top 0.15: R222.2 31.24,33.74 v31.24,36.58
  Bottom 0.15: U201.P$11 31.21,36.54 arc-90 v31.24,36.58
GSM_DTR  (via drill 0.3)
  Top 0.15: R171.2 82.38,21.17 87.38,26.16 87.38,40.64 87.25,40.77 29.34,40.77 29.21,40.64 v29.21,36.58
  Bottom 0.15: U201.P$9 v29.21,36.58
GSM_NETLIGHT  (via drill 0.3)
  Top 0.15: v32.38,0.64 v32.38,4.45 | v42.67,5.84 42.67,6.6 45.47,9.4 45.47,15.62 v45.72,15.62 | v35.94,4.45 v38.48,4.45 | U101.5 v61.98,18.03
  Bottom 0.15: v32.38,4.45 v35.94,4.45 | v42.67,5.84 42.67,5.46 41.66,4.45 40.13,4.45 39.75,4.06 38.61,4.06 v38.48,4.45 | v45.72,15.62 59.56,15.62 v61.98,18.03 | R231.2 21.46,0.64 v32.38,0.64
GSM_NETLIGHT_DRV
  Bottom 0.15: U201.P$50 22.21,9.47 R231.1
GSM_PCM_CLK  (via drill 0.3)
  Top 0.15: R141.2 68.45,4.95 65.41,1.91 37.21,1.91 37.08,1.78 36.32,1.78 v35.31,2.79
  Bottom 0.15: U201.P$46 26.21,9.78 26.16,9.78 26.16,2.79 v35.31,2.79
GSM_PCM_CLK_DRV
  Top 0.15: R141.1 73.13,6.24 U101.27
GSM_PCM_IN  (via drill 0.3)
  Top 0.15: R142.2 67.69,2.92 66.29,1.52 37.34,1.52 37.21,1.4 35.94,1.4 v35.31,2.03
  Bottom 0.15: v35.31,2.03 25.21,2.03 U201.P$47
GSM_PCM_IN_DRV
  Top 0.15: R142.1 72.52,3.68 74.68,5.84 74.68,7.44 U101.29
GSM_PCM_OUT  (via drill 0.3)
  Top 0.15: U101.28 73.91,5.97 v72.9,4.95 | v67.06,4.57 64.77,2.29 36.58,2.29 v36.32,2.54
  Bottom 0.15: v72.9,4.95 72.39,4.57 v67.06,4.57 | v36.32,2.54 36.32,1.91 35.94,1.52 24.26,1.52 R233.2
GSM_PCM_OUT_DRV
  Bottom 0.15: U201.P$48 24.26,10.41 R233.1
GSM_PCM_SYNC  (via drill 0.3)
  Top 0.15: U101.26 72.31,7.54 arc-90 72.39,7.62 72.39,6.35 72.14,6.1 67.56,6.1 64.14,2.67 37.34,2.67 36.45,3.56 v35.31,3.56
  Bottom 0.15: R234.2 27.3,3.56 v35.31,3.56
GSM_PCM_SYNC_DRV
  Bottom 0.15: U201.P$45 27.3,8.43 R234.1
GSM_PWRKEY  (via drill 0.3)
  Top 0.15: R162.2 82.21,11.85 81.66,11.81 82.17,11.81 82.8,12.45 82.8,15.24 84.33,16.76 84.33,18.03 88.9,22.61 88.9,37.72 89.41,38.23 89.41,41.4 89.28,41.53 28.32,41.53 28.19,41.4 v28.19,36.58
  Bottom 0.15: U201.P$8 28.21,36.56 arc90 v28.19,36.58
GSM_RESET  (via drill 0.3)
  Top 0.15: v83.82,21.21 87.76,25.15 87.76,39.24 87.88,39.37 v88.27,39.37 | v57.28,39.37 57.15,39.5 36.32,39.5 36.2,39.37 v36.2,36.58
  Bottom 0.15: U201.P$16 36.2,35.27 v36.2,36.58 | R163.2 83.4,20.79 v83.82,21.21 | v57.28,39.37 v88.27,39.37
GSM_RF
  Bottom 0.64: R271.1 13.34,28.87 C271.1 U201.P$66
GSM_RF_SYNC  (via drill 0.3)
  Top 0.15: 63.32,18.8 U101.4 62.05,18.85 v61.98,18.92 | v44.07,21.84 13.97,21.84 13.08,22.73 v13.08,24.89
  Bottom 0.15: v44.07,21.84 59.31,21.84 v61.98,18.92 65.15,18.8 C141.1 | v13.08,24.89 13.08,25.78 R241.2
GSM_RF_SYNC_DRV
  Bottom 0.15: U201.P$63 16.73,25.78 R241.1
GSM_RI  (via drill 0.3)
  Top 0.15: R221.2 30.23,33.49 v30.23,36.58
  Bottom 0.15: U201.P$10 30.21,36.56 arc-90 v30.23,36.58
GSM_RTS  (via drill 0.3)
  Top 0.15: v75.44,25.27 82.04,25.27 85.47,28.7 85.47,35.94 85.22,36.2 85.22,37.97 84.45,38.73 84.45,40.26 84.33,40.39 33.27,40.39 33.15,40.26 v33.15,36.58
  Bottom 0.15: U201.P$13 33.21,36.51 arc90 v33.15,36.58 | R173.2 74.93,25.4 75.18,25.15 v75.44,25.27
GSM_RXD  (via drill 0.3)
  Top 0.15: R172.2 81.92,23.11 86.61,27.81 86.61,36.32 86.36,36.58 86.36,37.08 86.74,37.47 86.74,39.75 v86.61,39.88 | v83.82,39.88 35.31,39.88 35.18,39.75 v35.18,36.58
  Bottom 0.15: U201.P$15 35.18,35.29 v35.18,36.58 | v86.61,39.88 v83.82,39.88
GSM_STATUS  (via drill 0.3)
  Top 0.15: v77.6,12.06 77.72,12.19 77.72,12.95 78,13.23 U101.38 | v75.82,6.1 73.03,3.3 73.03,1.14 37.47,1.14 37.34,1.02 v35.31,1.02
  Bottom 0.15: v77.6,12.06 78.36,11.43 78.36,6.86 77.47,6.1 v75.82,6.1 | v35.31,1.02 35.18,1.02 35.05,1.14 22.86,1.14 R232.2
GSM_STATUS_DRV
  Bottom 0.15: U201.P$49 23.21,5.26 R232.1
GSM_TXD  (via drill 0.3)
  Top 0.15: R224.2 34.16,34.38 v34.16,36.58
  Bottom 0.15: U201.P$14 34.21,36.53 arc90 v34.16,36.58
GSM_VDD_EXT  (via drill 0.3)
  Top 0.15: v83.82,18.67 88.52,23.37 88.52,37.85 89.03,38.35 89.03,41.02 88.9,41.15 28.83,41.15 28.7,41.02 v28.7,33.53
  Bottom 0.15: U201.P$7 27.21,33.75 27.43,33.53 v28.7,33.53 | R161.2 83.4,17.87 v83.82,18.67
I2C2_INT  (via drill 0.3)
  Top 0.15: U101.6 61.75,17.25 58.8,20.19 v58.8,22.48 | v57.28,22.48 55.75,22.48 R301.2
  Bottom 0.15: v58.8,22.48 v57.28,22.48
IO_ADC4  (via drill 0.3)
  Top 0.15: U101.2 62.74,20.45 62.74,20.32 62.1,20.95 v61.47,20.95
  g2 0.15: v61.47,20.95 59.94,19.43 59.94,17.53 59.05,16.64 49.4,16.64 47.75,14.99 47.75,13.72 48.26,13.21 50.29,13.21 JP181.3
IO_ADC5  (via drill 0.3)
  Top 0.15: U101.3 62.53,19.63 v61.98,20.19
  g2 0.15: v61.98,20.19 60.45,18.67 60.45,17.27 59.31,16.13 50.67,16.13 JP181.5
IO_DAC0  (via drill 0.3)
  Top 0.15: U101.8 61.98,15.65 v61.98,15.62
  g2 0.15: v61.98,15.62 61.72,15.37 61.21,15.37 60.96,15.11 56.64,15.11 55.88,14.35 55.88,11.3 55.24,10.67 52.45,10.67 JP181.4
IO_DAC1  (via drill 0.3)
  Top 0.15: U101.9 61.47,14.83 v61.47,14.73
  g2 0.15: v61.47,14.73 60.96,14.22 60.96,10.92 60.07,10.16 50.55,10.16 JP181.6
IO_OC1A  (via drill 0.3)
  Top 0.15: U101.30 75.51,8.31 v75.18,8.64
  g2 0.15: JP181.2 54.99,11.81 55.37,12.19 55.37,14.61 56.39,15.62 60.71,15.62 61.47,16.38 62.61,16.38 65.28,13.72 70.1,13.72 v75.18,8.64
J_D+  (via drill 0.3)
  Top 0.15: R724.1 91.31,28.57 92.08,27.81 v92.58,27.81
  Top 0.35: J701.D+ 93.6,27.81 v92.58,27.81
  Bottom 0.35: R723.1 89.92,27.18 91.19,27.18 arc37 91.82,27.3 92.46,27.69 arc-90 v92.58,27.81
J_D-  (via drill 0.3)
  Top 0.35: J701.D- 93.89,27.26 93.81,27.26 v92.96,27.05
  Bottom 0.35: R722.1 91.44,24.89 | 91.44,24.89 91.82,24.89 | R721.1 91.44,23.11 arc53 91.82,23.88 91.82,24.64 | 91.82,24.64 91.82,24.89 | 91.82,24.89 91.82,25.15 | 91.82,25.15 91.82,25.53 arc-44 92.39,26.6 v92.96,27.05 | 91.44,24.89 91.82,25.15 | 91.44,24.89 91.82,24.64
J_ID  (via drill 0.3)
  Top 0.15: J701.ID 93.2,28.59 v92.96,28.57
  Bottom 0.15: R725.1 v92.96,28.57
J_SHIELD  (via drill 0.3)
  Top 0.15: 96.27,31.85 arc90 J701.JSHIELD@6 J701.JSHIELD@5 J701.JSHIELD@4 J701.JSHIELD@3 94.97,24.74 J701.JSHIELD | 96.27,31.85 96.27,30.44 J701.JSHIELD@2 | 96.27,31.85 96.39,31.85 96.39,33.4 96.27,33.53 v95.38,33.53
  Bottom 0.15: C701.1 91.73,33.74 91.95,33.53 v95.38,33.53 95.38,32.55 R701.1
J_VUSB  (via drill 0.3)
  Top 0.406: v92.84,24.51 arc-90 94.08,26.64 J701.VBUS
  Bottom 0.4: v92.84,24.51 arc-30 RPOLY711.1
MPU_INT
  Top 0.15: R301.1 51.52,22.48 51.05,22.99 50.93,23.32 U301.12
PDI_CLK  (via drill 0.3)
  Top 0.15: JP131.5 R132.1 R112.1 75.78,29.25 73.41,31.62 v73.41,31.88 | v58.04,25.65 58.04,15.75 58.42,15.37 58.42,10.16 JP111.6
  Bottom 0.15: v73.41,31.88 73.41,33.66 74.55,34.8 74.55,36.32 73.91,37.08 64.52,37.08 64.14,36.7 64.14,31.11 63.12,30.1 62.48,30.1 61.34,28.96 61.34,26.8 59.18,26.8 v58.04,25.65
PDI_CLK_CPU
  Top 0.15: U101.57 70.74,23.01 70.74,23.75 71.54,24.51 73.79,26.67 R132.2
PDI_DATA
  Bottom 0.15: R131.1 77.72,30.73 JP131.1
PDI_DATA_CPU  (via drill 0.3)
  Top 0.15: U101.56 71.53,23.9 72.39,24.77 74.17,24.77 74.93,25.53 74.93,27.3 74.68,27.56 73.79,27.56 73.28,28.07 v73.28,30.73
  Bottom 0.15: v73.28,30.73 R131.2
POWERED_GSM  (via drill 0.3)
  Top 0.15: U101.39 77.9,14.05 77.72,14.22 77.72,14.86 v77.6,14.99
  Bottom 0.15: R161.1 81.28,17.36 81.28,15.24 81.03,14.99 v77.6,14.99
PWRKEY_GSM
  Top 0.15: R162.1 80.81,13.55 79.5,14.86 78.89,14.86 U101.40
RESET_GSM  (via drill 0.3)
  Top 0.15: U101.41 77.95,15.65 77.72,15.88 77.72,16.89 v77.6,17.02
  Bottom 0.15: R163.1 80.52,19.14 80.52,17.4 80.26,17.14 77.72,17.14 v77.6,17.02
RI1  (via drill 0.3)
  Top 0.15: U101.50 76.33,24.13 76.45,24.26 82.42,24.26 86.23,28.07 86.23,36.2 85.98,36.45 85.98,37.21 86.36,37.59 86.36,38.86 86.23,38.99 85.34,38.99 v85.22,38.86 | R221.1 30.1,29.59 30.35,29.34 35.69,29.34 42.93,36.58 v42.93,38.86
  Bottom 0.15: v85.22,38.86 88.65,38.86 88.77,38.99 88.77,40.26 88.65,40.39 43.05,40.39 42.93,40.26 v42.93,38.86
RTS1  (via drill 0.3)
  Top 0.15: U101.54 73.13,23.98 73.53,24.38 74.55,24.38 74.8,24.64 82.17,24.64 85.85,28.32 85.85,36.07 85.6,36.32 85.6,37.34 85.85,37.59 v85.85,38.35 | R223.1 33.49,30.39 33.78,30.1 35.43,30.1 41.4,36.07 v41.4,38.86
  Bottom 0.15: v85.85,38.35 86.49,37.72 89.03,37.72 89.53,38.23 89.53,41.02 89.41,41.15 41.53,41.15 41.4,41.02 v41.4,38.86
RXD1  (via drill 0.3)
  Top 0.15: U101.48 79.4,21.23 80.14,21.97 81.92,21.97 87,27.05 87,36.7 v86.87,36.83 | R224.1 36.23,31.41 40.64,35.81 v40.64,38.86
  Bottom 0.15: v86.87,36.83 88.65,36.83 91.19,38.1 91.19,41.4 91.06,41.53 40.77,41.53 40.64,41.4 v40.64,38.86
SCL1  (via drill 0.3)
  Top 0.15: 45.72,20.45 45.09,19.81 45.09,9.65 42.29,6.73 42.29,6.22 v41.27,5.08 48.64,5.08 v49.15,5.59 | 45.72,20.45 45.72,27.05 45.97,27.3 v48.26,27.3 | U301.23 49.28,26.43 49.28,27.18 v49.4,27.3 50.13,28.04 U401.8 | U501.4 47,16.88 46.86,16.89 45.73,18.03 45.72,20.45 | U101.37 79.5,12.45 80.26,11.68 80.26,11.18 80.64,10.79 v80.9,10.79 | v35.94,5.59 38.23,5.59 38.48,5.84 v38.48,5.97 | R401.1 46.61,35.6 46.61,34.16 45.09,32.64 v45.09,32.51
  Bottom 0.15: v49.15,5.59 49.53,5.21 50.42,5.21 51.05,4.57 51.56,4.57 51.82,4.83 64.26,4.83 65.66,3.43 77.09,3.43 80.9,7.24 v80.9,10.79 | v48.26,27.3 48.39,27.3 | v49.4,27.3 v48.26,27.3 | v35.94,5.59 33.53,5.59 32.98,6.13 R212.2 32.98,6.31 33.02,6.35 33.02,6.6 32.64,6.73 32.64,9.27 33.02,9.65 33.02,10.27 U201.P$39 | v38.48,5.97 39.62,4.83 41.02,4.83 v41.27,5.08 | v45.09,32.51 47.12,30.48 48.26,30.48 v48.26,27.3
SCL2
  Top 0.15: U101.17 65.13,6.45 63.5,4.83 52.83,4.83 51.69,5.97 51.69,7.62 JP121.2
SDA1  (via drill 0.3)
  Top 0.15: v36.07,7.62 36.07,7.87 36.2,8 v40.01,8 | U101.36 arc-90 78.92,11.68 79.38,11.68 79.88,11.18 79.88,10.54 v80.26,10.16 | v51.31,5.21 49.66,5.21 49.15,4.7 41.91,4.7 41.66,4.45 40.89,4.45 40.51,4.83 40.51,5.46 v41.53,6.48 44.7,9.78 44.7,19.94 45.34,20.57 | 45.34,20.57 45.34,27.94 | 45.34,27.94 48.9,27.94 | 48.9,27.94 48.9,26.46 U301.24 | 45.34,20.57 45.21,20.7 v44.96,20.7 | U501.1 46.9,18.38 46.61,18.67 46.61,20.49 v46.35,20.7 | 48.9,27.94 48.88,27.95 U401.7 | R402.1 44.45,31.62 45.34,30.73 45.34,27.94
  Bottom 0.15: U201.P$38 34.29,10.38 34.29,8.64 33.91,8.26 R211.2 33.87,8.04 34.42,7.49 35.94,7.49 v36.07,7.62 | v40.01,8 v41.53,6.48 | v51.31,5.21 64.64,5.21 66.04,3.81 76.83,3.81 80.26,7.24 v80.26,10.16 | v46.35,20.7 v44.96,20.7
SDA2
  Top 0.15: U101.16 63.37,8.38 60.2,5.21 53.98,5.21 JP121.4
SIM_CLK  (via drill 0.3)
  Top 0.15: J801.S3 19.68,4.57 19.56,4.7 18.54,4.7 18.41,4.83 18.41,19.3 38.1,19.3 39.37,17.78 42.67,17.78 v42.93,18.03
  Bottom 0.15: U201.P$31 42.93,17.86 v42.93,18.03
SIM_IO  (via drill 0.3)
  Top 0.15: J801.S7 19.81,5.59 18.91,5.59 18.8,5.71 18.8,18.92 37.59,18.92 38.99,17.4 43.31,17.4 43.56,17.65 43.56,18.54 43.18,18.92 v42.93,18.92
  Bottom 0.15: U201.P$30 42.93,18.86 v42.93,18.92
SIM_RST  (via drill 0.3)
  Top 0.15: J801.S2 34.05,4.57 34.16,4.57 34.54,4.95 38.23,4.95 43.56,10.29 43.56,16.26 43.05,16.76 v42.93,16.76
  Bottom 0.15: U201.P$32 42.9,16.86 v42.93,16.76
SIM_VBUS
  Bottom 0.406: U201.P$25 43.42,23.86 44.32,24.77 44.32,25.15 JP201.2
SIM_VCC  (via drill 0.3)
  Top 0.15: J801.S1 34.54,4.06 35.56,4.06 35.69,3.94 38.99,3.94 38.99,5.21 43.94,10.16 43.94,19.43 43.56,19.81 v42.93,19.81
  Bottom 0.15: U201.P$29 42.88,19.86 v42.93,19.81
SIM_VPP  (via drill 0.3)
  Top 0.15: J801.S6 34.11,5.46 34.16,5.46 34.92,6.22 36.45,6.22 36.7,6.48 39.24,6.48 43.18,10.41 43.18,15.62 v42.93,15.88
  Bottom 0.15: U201.P$33 41.62,15.88 v42.93,15.88
SW  (via drill 0.3)
  Top 0.15: U1111.1 56.92,33.15 v57.4,33.15 57.28,33.02 57.15,33.02 | L1111.2 60.96,31.75
  Top 0.406: 60.96,31.75 58.8,31.75 v57.4,33.15
  Bottom 0.15: D1111.C 57.4,32.43 v57.4,33.15
TCK  (via drill 0.3)
  Top 0.15: U101.12 62.23,12.45 61.47,11.68 v61.47,9.27 | v65.15,5.59 63.37,3.81 JP111.1
  Bottom 0.15: v61.47,9.27 61.47,6.86 62.23,6.1 64.64,6.1 v65.15,5.59
TCXO_20MHZ
  Top 0.15: U101.59 69.11,25.29 R1013.2
TDI
  Top 0.15: 59.56,13.97 JP111.9 60.43,13.23 U101.11
TDO
  Top 0.15: U101.13 62.43,11.63 62.1,11.3 62.1,8.76 JP111.3
TMS  (via drill 0.3)
  Top 0.15: v61.92,14.05 U101.10
  Bottom 0.15: 62.18,14.05 v61.92,14.05 61.09,13.21 61.09,10.29 JP111.5
TOSC1
  Top 0.15: U101.43 80.77,17.25 Q101.2
TOSC2
  Top 0.15: Q101.1 80.11,16.43 U101.42
TRSH  (via drill 0.3)
  Top 0.15: U1011.4 68.56,29.11 v68.2,29.59
  Bottom 0.15: C1011.1 67.82,29.08 v68.2,29.59 68.16,29.68 R1011.2 68.58,30.48 68.2,30.86 68.2,33.27 68.41,33.06 R1012.1
TXD1
  Top 0.15: R172.1 78.87,22.99 | 78.99,22.99 78.87,22.99 | 78.87,22.99 U101.49
USB_D_N  (via drill 0.3)
  Top 0.35: U101.32 77.24,7.37 79.38,7.37 arc30 80.35,7.75 83.57,11.18 arc-37 83.88,11.41 84.96,11.41 | D722.C 84.96,11.41 | 84.96,11.41 85.32,11.3 v85.85,11.3
  Bottom 0.35: v85.85,11.3 86.32,11.3 arc46 86.74,11.43 88.92,13.53 arc48 89.15,14.22 89.15,20.19 arc38 89.03,20.57 86.89,22.8 arc-51 86.74,23.11 86.74,24.77 arc-88 87.12,25.27 87.88,25.27 87.92,25.02 R722.2
USB_D_P  (via drill 0.3)
  Top 0.35: U101.33 78.61,9.14 78.61,8.76 arc117 80.03,8.23 83.31,11.68 arc-52 83.89,11.96 84.96,11.96 D721.C 85.23,12.32 v85.85,12.32
  Bottom 0.35: v85.85,12.32 86.66,12.32 arc57 87.12,12.57 88.5,13.9 arc41 88.65,14.22 88.65,20.07 arc44 88.52,20.32 86.34,22.54 arc-49 86.23,22.73 86.23,25.15 arc-53 86.36,25.4 87.61,26.54 R723.2
USB_ID  (via drill 0.3)
  Top 0.15: v67.18,14.35 66.29,14.35 64.21,16.43 U101.7
  Bottom 0.15: v67.18,14.35 83.57,14.35 83.95,14.61 87.88,18.67 87.88,19.94 85.09,22.86 85.09,26.67 88.27,29.84 R725.2
USB_RESET
  Bottom 0.15: R151.2 73.7,13.72 75.18,13.72 75.56,13.34 77.34,13.34 77.85,12.83 80.26,12.83 82.93,10.16 87.12,10.16 90.04,13.08 90.04,21.21 90.08,22.31 R721.2
USB_RESET_DRV  (via drill 0.3)
  Top 0.15: U101.31 v76.33,8.64
  Bottom 0.15: R151.1 arc-90 74.93,12.28 74.93,9.91 v76.33,8.64
VBAT  (via drill 0.3)
  Top 0.15: v52.45,38.23 52.45,31.88 53.85,30.48 53.85,27.56 54.61,26.8 57.87,26.8 R1132.1
  Top 0.254: v58.42,38.23 v52.45,38.23 | 18.16,36.58 24.51,36.58 v24.77,36.32 | C201.1 17.65,36.07 18.16,36.58 | D201.C 16.89,37.85 18.16,36.58
  Bottom 0.15: U201.P$4 24.26,35.31 | U201.P$5 25.15,35.58 | U201.P$6 26.16,35.31
  Bottom 0.225: 24.26,35.31 24.26,36.07
  Bottom 0.254: D1122.A 80.44,38.23 v58.42,38.23 | v52.45,38.23 28.57,38.23 27.3,36.96 arc-90 26.67,36.45 26.42,36.45 26.16,36.07
  Bottom 0.35: 26.16,35.31 26.16,36.07 | 24.26,36.07 24.77,36.07 v24.77,36.32
  Bottom 0.406: 25.15,35.58 25.4,36.07
  Bottom 0.64: v24.77,36.32 RPOLY901.2 23.11,37.72 C901.1 | 24.26,36.07 25.4,36.07 26.16,36.07
VC_OP_FB
  Top 0.15: U1021.4 65.15,30.45 64.39,29.21 64.39,27.69 64.77,27.69 64.77,27.56 | R1021.1 64.9,27.52 64.9,27.56 64.77,27.56 | 64.77,27.43 64.77,27.56
VDD_ANA@1
  Top 0.225: U601.1 C611.1
VDD_ANA@5
  Top 0.15: U601.5 82.15,4.81 | 82.8,5.46 83.1,5.46 C612.1
  Top 0.225: 82.15,4.81 82.8,5.46
VIN  (via drill 0.3)  (2 unrouted)
  Top 0.15: U1121.3 75.89,33.35 76.33,33.78 76.33,34.92 75.89,35.36 U1121.4 76.82,36.51 C1121.1 77.47,36.45 | R1113.1 56.73,28.01 56.82,28.01
  Top 0.254: v79.76,36.45 77.47,36.45 | C1111.1 56.82,28.01 U1111.5 | 77.47,37.08 75.69,38.86 64.9,38.86 64.14,38.1 64.14,30.48 63.12,29.46 60.96,29.46 59.56,28.07
  Top 0.406: 77.47,36.58 77.47,37.08
  Bottom 0.254: v79.76,36.45 81.28,34.92 D1122.C D1121.C
VREF
  Bottom 0.15: R111.1 55.43,6.35 JP111.4
XO_AMP
  Top 0.15: R1013.1 70.7,26.55 U1011.1
XO_DRV
  Top 0.15: U1011.3 71.14,30.45 71.12,30.48 71.12,31 U1001.3
XO_LP  (via drill 0.3)
  Top 0.15: R1002.1 C1001.1 | R1002.1 65.19,33.13 U1021.3 | R1002.1 65.19,34.89 v65.91,34.16
  Bottom 0.15: R1001.2 65.32,34.76 v65.91,34.16
XO_VC
  Top 0.15: U1001.1 R1002.2
XO_VC_PWM  (via drill 0.3)
  Top 0.15: v59.05,23.5 v59.05,24.77 | v65.53,8.76 65.91,8.38 U101.18
  Bottom 0.15: v65.53,8.76 65.53,9.27 65.66,9.4 67.06,9.4 67.18,9.53 67.18,13.46 66.55,14.1 66.55,19.05 64.01,21.59 60.96,21.59 v59.05,23.5 | R1001.1 65.02,33.02 64.64,32.64 64.64,30.99 63.25,29.59 62.61,29.59 61.85,28.83 61.85,26.42 61.72,26.29 60.07,26.29 59.05,25.27 v59.05,24.77

## Text on the board
Top: Layer-1
g2: Layer-2 | DF4IAH / FindMeSAT / V1.0
g15: Layer-3
Bottom: Layer-4
tPlace: GSM antenna | DF4IAH FindMeSAT V1.0 | USB | 1 | GND | LiPo | + | PDI | POW | VHF | 1 | I/O | Bluetooth antenna | 1 | LCD | JTAG | 1 | GPS